# EAGLE design BUZZI-38 (EAGLE 4.15)
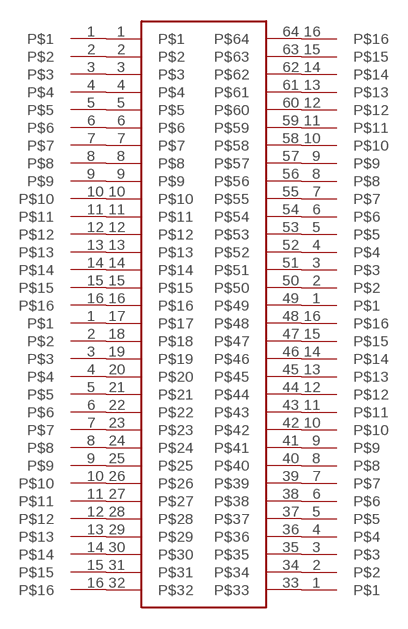
[diagram p0: schematic, sheet 1]

## Parts
1-16  MA16  [MA16-1]
17-32  MA16  [MA16-1]
33-48  MA16  [MA16-1]
49-64  MA16  [MA16-1]
U$1  QFP-64  GENERIC64PIN  [TSQFP50P1200X1200X160-64N]

## Nets
N$1: 1-16.1 U$1.1
N$2: 1-16.2 U$1.2
N$3: 1-16.3 U$1.3
N$4: 1-16.4 U$1.4
N$5: 1-16.5 U$1.5
N$6: 1-16.6 U$1.6
N$7: 1-16.7 U$1.7
N$8: 1-16.8 U$1.8
N$9: 1-16.9 U$1.9
N$10: 1-16.10 U$1.10
N$11: 1-16.11 U$1.11
N$12: 1-16.12 U$1.12
N$13: 1-16.13 U$1.13
N$14: 1-16.14 U$1.14
N$15: 1-16.15 U$1.15
N$16: 1-16.16 U$1.16
N$17: 17-32.1 U$1.17
N$18: 17-32.2 U$1.18
N$19: 17-32.3 U$1.19
N$20: 17-32.4 U$1.20
N$21: 17-32.5 U$1.21
N$22: 17-32.6 U$1.22
N$23: 17-32.7 U$1.23
N$24: 17-32.8 U$1.24
N$25: 17-32.9 U$1.25
N$26: 17-32.10 U$1.26
N$27: 17-32.11 U$1.27
N$28: 17-32.12 U$1.28
N$29: 17-32.13 U$1.29
N$30: 17-32.14 U$1.30
N$31: 17-32.15 U$1.31
N$32: 17-32.16 U$1.32
N$33: 33-48.1 U$1.33
N$34: 33-48.2 U$1.34
N$35: 33-48.3 U$1.35
N$36: 33-48.4 U$1.36
N$37: 33-48.5 U$1.37
N$38: 33-48.6 U$1.38
N$39: 33-48.7 U$1.39
N$40: 33-48.8 U$1.40
N$41: 33-48.9 U$1.41
N$42: 33-48.10 U$1.42
N$43: 33-48.11 U$1.43
N$44: 33-48.12 U$1.44
N$45: 33-48.13 U$1.45
N$46: 33-48.14 U$1.46
N$47: 33-48.15 U$1.47
N$48: 33-48.16 U$1.48
N$49: 49-64.1 U$1.49
N$50: 49-64.2 U$1.50
N$51: 49-64.3 U$1.51
N$52: 49-64.4 U$1.52
N$53: 49-64.5 U$1.53
N$54: 49-64.6 U$1.54
N$55: 49-64.7 U$1.55
N$56: 49-64.8 U$1.56
N$57: 49-64.9 U$1.57
N$58: 49-64.10 U$1.58
N$59: 49-64.11 U$1.59
N$60: 49-64.12 U$1.60
N$61: 49-64.13 U$1.61
N$62: 49-64.14 U$1.62
N$63: 49-64.15 U$1.63
N$64: 49-64.16 U$1.64

## Library data of the parts
1-16 17-32 33-48 49-64 = turbod3:MA16
U$1 = turbod3:GENERIC64PIN

## Net classes
0 default: width 0.152 mm

## Board
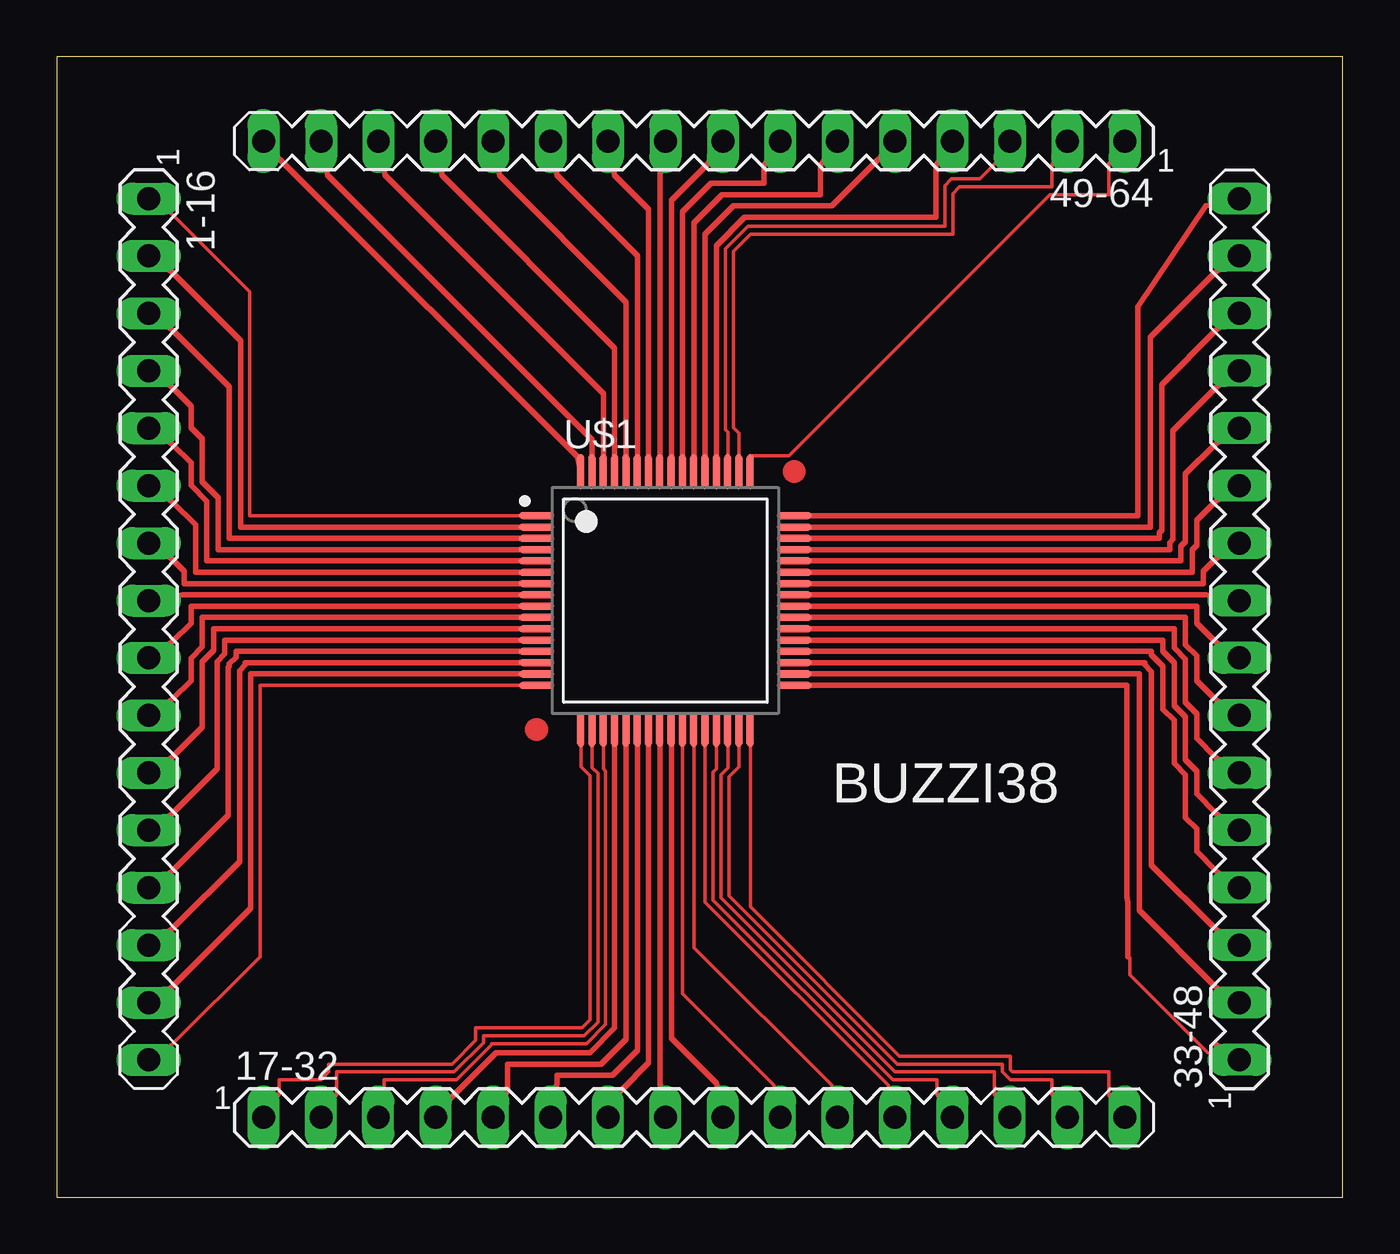
[diagram p1: board, top side]

Size 56.92 x 50.46 mm. Coordinates in mm from the lower left corner, seen from the top.
Outline: 0,0 56.92,0 56.92,50.46 0,50.46 0,0
Copper layers (1*16): Top 0.035mm / dielectric 1.5mm / Bottom 0.035mm
Design rules "PCB-POOL": minimum track width 6mil, minimum drill 12mil, track to track 6mil, track to pad 6mil, pad to pad 6mil, via to via 6mil, smd to smd 6mil, copper to edge 20mil, drill to drill 8mil, minimum pad ring 8mil, minimum via ring 6mil, stop-mask expansion 3mil, vias tented up to drill 0mil, thermal gap 8mil

### Footprints (pad centres in the part's own frame; a part is rotated, then mirrored left to right if it is on the bottom)
MA16-1 = drill 1.016 long: 1 -17.78,0; 2 -15.24,0; 3 -12.7,0; 4 -10.16,0; 5 -7.62,0; 6 -5.08,0; 7 -2.54,0; 8 0,0; 9 2.54,0; 10 5.08,0; 11 7.62,0; 12 10.16,0; 13 12.7,0; 14 15.24,0; 15 17.78,0; 16 20.32,0
TSQFP50P1200X1200X160-64N = smd 1.55 x 0.3: 1 -5.7,3.75; 2 -5.7,3.25; 3 -5.7,2.75; 4 -5.7,2.25; 5 -5.7,1.75; 6 -5.7,1.25; 7 -5.7,0.75; 8 -5.7,0.25; 9 -5.7,-0.25; 10 -5.7,-0.75; 11 -5.7,-1.25; 12 -5.7,-1.75; 13 -5.7,-2.25; 14 -5.7,-2.75; 15 -5.7,-3.25; 16 -5.7,-3.75; 33 5.7,-3.75; 34 5.7,-3.25; 35 5.7,-2.75; 36 5.7,-2.25; 37 5.7,-1.75; 38 5.7,-1.25; 39 5.7,-0.75; 40 5.7,-0.25; 41 5.7,0.25; 42 5.7,0.75; 43 5.7,1.25; 44 5.7,1.75; 45 5.7,2.25; 46 5.7,2.75; 47 5.7,3.25; 48 5.7,3.75 | smd 0.3 x 1.55: 17 -3.75,-5.7; 18 -3.25,-5.7; 19 -2.75,-5.7; 20 -2.25,-5.7; 21 -1.75,-5.7; 22 -1.25,-5.7; 23 -0.75,-5.7; 24 -0.25,-5.7; 25 0.25,-5.7; 26 0.75,-5.7; 27 1.25,-5.7; 28 1.75,-5.7; 29 2.25,-5.7; 30 2.75,-5.7; 31 3.25,-5.7; 32 3.75,-5.7; 49 3.75,5.7; 50 3.25,5.7; 51 2.75,5.7; 52 2.25,5.7; 53 1.75,5.7; 54 1.25,5.7; 55 0.75,5.7; 56 0.25,5.7; 57 -0.25,5.7; 58 -0.75,5.7; 59 -1.25,5.7; 60 -1.75,5.7; 61 -2.25,5.7; 62 -2.75,5.7; 63 -3.25,5.7; 64 -3.75,5.7

### Placement (x,y rotation side)
1-16  4.08,26.4 270 top
17-32  26.94,3.54 0 top
33-48  52.34,23.86 90 top
49-64  29.48,46.72 180 top
U$1  26.94,26.4 0 top

### Tracks (layer width: path | path; a pad name or v marks a point on that pad's centre or on a via)
N$1
  Top 0.152: U$1.1 8.55,30.15 8.55,40.05 5.1,43.5 1-16.1
N$2
  Top 0.254: U$1.2 8.15,29.65 8.15,37.9 5.15,40.9 1-16.2
N$3
  Top 0.254: U$1.3 7.65,29.15 7.65,35.85 5.15,38.35 1-16.3
N$4
  Top 0.254: U$1.4 7.15,28.65 7.15,30.95 6.45,31.65 6.45,33.55 5.95,34.05 5.95,35 5.15,35.8 1-16.4
N$5
  Top 0.254: U$1.5 6.65,28.15 6.65,30.8 5.95,31.5 5.95,32.5 5.15,33.3 1-16.5
N$6
  Top 0.254: U$1.6 6.15,27.65 6.15,29.75 5.15,30.75 1-16.6
N$7
  Top 0.254: U$1.7 5.65,27.15 5.65,27.7 5.15,28.2 1-16.7
N$8
  Top 0.254: U$1.8 5.6,26.65 1-16.8
N$9
  Top 0.254: U$1.9 5.95,26.15 5.95,25.4 5.15,24.6 1-16.9
N$10
  Top 0.254: U$1.10 6.45,25.65 6.45,24.35 5.95,23.85 5.95,22.85 5.15,22.05 1-16.10
N$11
  Top 0.254: U$1.11 6.95,25.15 6.95,24.2 6.45,23.7 6.45,20.8 5.15,19.5 1-16.11
N$12
  Top 0.254: U$1.12 7.45,24.65 7.45,24.05 7.1,23.7 7.1,18.95 5.15,17 1-16.12
N$13
  Top 0.254: U$1.13 7.95,24.15 7.95,23.9 7.65,23.6 7.65,23.5 7.6,23.45 7.6,16.9 5.15,14.45 1-16.13
N$14
  Top 0.254: U$1.14 8.35,23.65 8.35,23.55 8.1,23.3 8.1,14.85 5.15,11.9 1-16.14
N$15
  Top 0.254: U$1.15 8.6,23.15 8.6,12.8 5.15,9.35 1-16.15
N$16
  Top 0.152: U$1.16 9,22.65 9,10.65 5.1,6.75 1-16.16
N$17
  Top 0.152: U$1.17 23.2,19.95 23.2,19.05 23.6,18.65 23.6,7.85 23.25,7.5 18.55,7.5 18.55,6.95 17.5,5.9 12.05,5.9 12.05,5.55 11.7,5.2 9.85,5.2 9.85,4.55 17-32.1
N$18
  Top 0.152: U$1.18 23.7,19.95 23.7,19 23.95,18.75 23.95,7.75 23.35,7.15 18.9,7.15 18.9,6.85 17.6,5.55 12.4,5.55 12.4,4.55 17-32.2
N$19
  Top 0.152: U$1.19 24.2,19.95 24.2,18.95 24.3,18.85 24.3,7.65 23.45,6.8 19.25,6.8 19.25,6.75 17.7,5.2 14.5,5.2 14.5,4.95 17-32.3
N$20
  Top 0.254: U$1.20 24.7,19.95 24.7,7.5 23.6,6.4 19.45,6.4 17.5,4.45 17-32.4
N$21
  Top 0.254: U$1.21 25.2,19.95 25.2,7 24.1,5.9 19.95,5.9 19.95,4.7 17-32.5
N$22
  Top 0.254: U$1.22 25.7,19.95 25.7,6.5 24.6,5.4 22.15,5.4 22.15,5.05 17-32.6
N$23
  Top 0.254: U$1.23 26.2,19.95 26.2,5.95 25,4.75 17-32.7
N$24
  Top 0.254: U$1.24 26.7,19.95 26.7,5.05 17-32.8
N$25
  Top 0.254: U$1.25 27.2,19.95 27.2,7.05 29.2,5.05 17-32.9
N$26
  Top 0.152: U$1.26 27.7,19.95 27.7,9 31.75,4.95 17-32.10
N$27
  Top 0.152: U$1.27 28.2,19.95 28.2,11.05 34.3,4.95 17-32.11
N$28
  Top 0.152: U$1.28 28.7,19.95 28.7,13.05 36.8,4.95 17-32.12
N$29
  Top 0.152: U$1.29 29.2,19.95 29.2,18.95 29.05,18.8 29.05,13.15 37,5.2 38.95,5.2 38.95,4.55 17-32.13
N$30
  Top 0.152: U$1.30 29.7,19.95 29.7,19 29.4,18.7 29.4,13.25 37.1,5.55 41.5,5.55 41.5,4.55 17-32.14
N$31
  Top 0.152: U$1.31 30.2,19.95 30.2,19.05 29.75,18.6 29.75,13.35 37.2,5.9 41.85,5.9 41.85,5.55 42.2,5.2 44.05,5.2 44.05,4.55 17-32.15
N$32
  Top 0.152: U$1.32 30.7,19.95 30.7,12.85 37.3,6.25 42.2,6.25 42.2,5.65 42.3,5.55 46.55,5.55 46.55,4.5 17-32.16
N$33
  Top 0.152: 33-48.1 50.95,6.4 47.5,9.85 47.5,10.6 47.4,10.65
  Top 0.254: 47.4,10.65 47.4,13.05 47.35,13.3 47.35,22.65 U$1.33 | 33-48.1 51.25,6.8
N$34
  Top 0.254: U$1.34 47.9,23.15 47.9,12.7 51.25,9.35 33-48.2
N$35
  Top 0.254: U$1.35 48.15,23.65 48.15,23.55 48.45,23.25 48.45,14.7 51.25,11.9 33-48.3
N$36
  Top 0.254: U$1.36 48.45,24.15 48.45,24 48.95,23.5 48.95,21.6 49.45,21.1 49.45,19.2 49.95,18.7 49.95,16.8 50.45,16.3 50.45,15.3 51.3,14.45 33-48.4
N$37
  Top 0.254: U$1.37 48.95,24.65 48.95,24.15 49.45,23.65 49.45,21.75 49.95,21.25 49.95,19.35 50.45,18.85 50.45,17.85 51.3,17 33-48.5
N$38
  Top 0.254: U$1.38 49.45,25.15 49.45,24.3 49.95,23.8 49.95,21.9 50.45,21.4 50.45,20.3 51.25,19.5 33-48.6
N$39
  Top 0.254: U$1.39 49.95,25.65 49.95,24.45 50.45,23.95 50.45,22.85 51.25,22.05 33-48.7
N$40
  Top 0.254: U$1.40 50.45,26.15 50.45,25.4 51.25,24.6 33-48.8
N$41
  Top 0.254: U$1.41 50.85,26.65 33-48.9
N$42
  Top 0.254: U$1.42 50.75,27.15 50.75,27.7 51.25,28.2 33-48.10
N$43
  Top 0.254: U$1.43 50.25,27.65 50.25,28.65 50.45,28.85 50.45,29.95 51.25,30.75 33-48.11
N$44
  Top 0.254: U$1.44 49.75,28.15 49.75,28.8 49.95,29 49.95,32 51.25,33.3 33-48.12
N$45
  Top 0.254: U$1.45 49.25,28.65 49.25,28.95 49.4,29.1 49.4,33.9 51.3,35.8 33-48.13
N$46
  Top 0.254: U$1.46 48.8,29.15 48.8,29.4 48.9,29.5 48.9,35.95 51.3,38.35 33-48.14
N$47
  Top 0.254: U$1.47 48.4,29.65 48.4,38.05 51.25,40.9 33-48.15
N$48
  Top 0.254: U$1.48 47.85,30.15 47.85,39.4 50.85,43.85 33-48.16
N$49
  Top 0.152: U$1.49 30.8,32.8 32.4,32.8 43.95,44.35 46.55,44.35 46.55,45.75 49-64.1
N$50
  Top 0.152: U$1.50 30.2,32.85 30.2,33.8 29.95,34.05 29.95,41.85 30.7,42.6 39.65,42.6 39.65,44.4 39.95,44.7 44.05,44.7 44.05,45.7 49-64.2
N$51
  Top 0.152: U$1.51 29.7,32.85 29.7,33.85 29.6,33.95 29.6,41.95 30.6,42.95 39.3,42.95 39.3,44.75 39.6,45.05 40.85,45.05 41.5,45.7 49-64.3
N$52
  Top 0.254: U$1.52 29.2,32.85 29.2,42.1 30.45,43.35 38.9,43.35 38.9,45.65 49-64.4
N$53
  Top 0.254: U$1.53 28.7,32.85 28.7,42.6 29.95,43.85 34.3,43.85 36.35,45.9 49-64.5
N$54
  Top 0.254: U$1.54 28.2,32.85 28.2,43.1 29.45,44.35 33.8,44.35 33.8,45.65 49-64.6
N$55
  Top 0.254: U$1.55 27.7,32.85 27.7,43.6 28.95,44.85 31.3,44.85 31.3,45.65 49-64.7
N$56
  Top 0.254: U$1.56 27.2,32.85 27.2,44.1 28.75,45.65 49-64.8
N$57
  Top 0.254: U$1.57 26.7,32.85 26.7,45.2 49-64.9
N$58
  Top 0.254: U$1.58 26.2,32.85 26.2,43.7 24.7,45.2 49-64.10
N$59
  Top 0.254: U$1.59 25.7,32.85 25.7,41.65 22.15,45.2 49-64.11
N$60
  Top 0.254: U$1.60 25.2,32.85 25.2,39.6 19.6,45.2 49-64.12
N$61
  Top 0.254: U$1.61 24.7,32.85 24.7,37.55 17.05,45.2 49-64.13
N$62
  Top 0.254: U$1.62 24.2,32.85 24.2,35.55 14.55,45.2 49-64.14
N$63
  Top 0.254: U$1.63 23.7,32.85 23.7,33.5 12,45.2 49-64.15
N$64
  Top 0.254: U$1.64 23.05,32.75 9.9,45.9 49-64.16

### Text on the board
tNames: BUZZI38